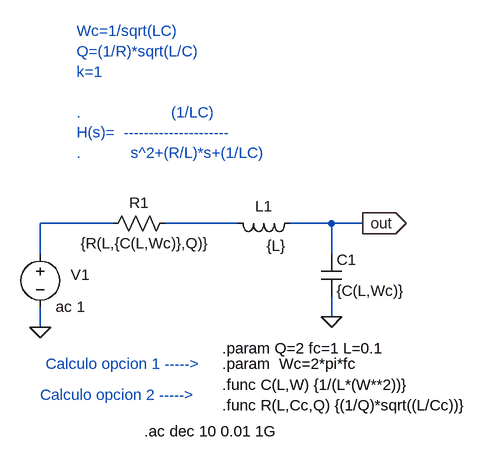
[diagram p0: schematic pasabajo.asc]
pasabajo.asc, the LTspice schematic file:
Version 4
SHEET 1 880 680
WIRE 16 96 -96 96
WIRE 208 96 96 96
WIRE 352 96 288 96
WIRE 400 96 352 96
WIRE -96 144 -96 96
WIRE 352 144 352 96
WIRE 352 240 352 208
WIRE -96 256 -96 224
FLAG 352 240 0
FLAG -96 256 0
FLAG 400 96 out
IOPIN 400 96 Out
SYMBOL res 112 80 R90
WINDOW 0 0 56 VBottom 2
WINDOW 3 31 45 VTop 2
SYMATTR InstName R1
SYMATTR Value {R(L,{C(L,Wc)},Q)}
SYMBOL ind 304 80 R90
WINDOW 0 5 56 VBottom 2
WINDOW 3 35 37 VTop 2
SYMATTR InstName L1
SYMATTR Value {L}
SYMBOL cap 336 144 R0
SYMATTR InstName C1
SYMATTR Value {C(L,Wc)}
SYMBOL voltage -96 128 R0
WINDOW 0 47 47 Left 2
WINDOW 123 0 0 Left 0
WINDOW 39 0 0 Left 0
SYMATTR InstName V1
SYMATTR Value ac 1
TEXT -40 -200 Left 2 ;Wc=1/sqrt(LC)\nQ=(1/R)*sqrt(L/C)\nk=1\n \n.                    (1/LC)\nH(s)=  ---------------------\n.           s^2+(R/L)*s+(1/LC)
TEXT 184 288 Left 2 !.param Q=2 fc=1 L=0.1
TEXT 184 312 Left 2 !.param  Wc=2*pi*fc
TEXT 184 376 Left 2 !.func R(L,Cc,Q) {(1/Q)*sqrt((L/Cc))}
TEXT 184 344 Left 2 !.func C(L,W) {1/(L*(W**2))}
TEXT 64 416 Left 2 !.ac dec 10 0.01 1G
TEXT -88 312 Left 2 ;Calculo opcion 1 ----->
TEXT -96 360 Left 2 ;Calculo opcion 2 ----->

The netlist it stands for:
* pasabajo.asc
R1 N002 N001 {R(L,{C(L,Wc)},Q)}
L1 out N002 {L}
C1 out 0 {C(L,Wc)}
V1 N001 0 ac 1
* Wc=1/sqrt(LC)
* Q=(1/R)*sqrt(L/C)
* k=1
* .                    (1/LC)
* H(s)=  ---------------------
* .           s^2+(R/L)*s+(1/LC)
.param Q=2 fc=1 L=0.1
.param  Wc=2*pi*fc
.func R(L,Cc,Q) {(1/Q)*sqrt((L/Cc))}
.func C(L,W) {1/(L*(W**2))}
.ac dec 10 0.01 1G
* Calculo opcion 1 ----->
* Calculo opcion 2 ----->
.backanno
.end